# Altium schematic sheet Quadrature Decoder.SchDoc
size A4
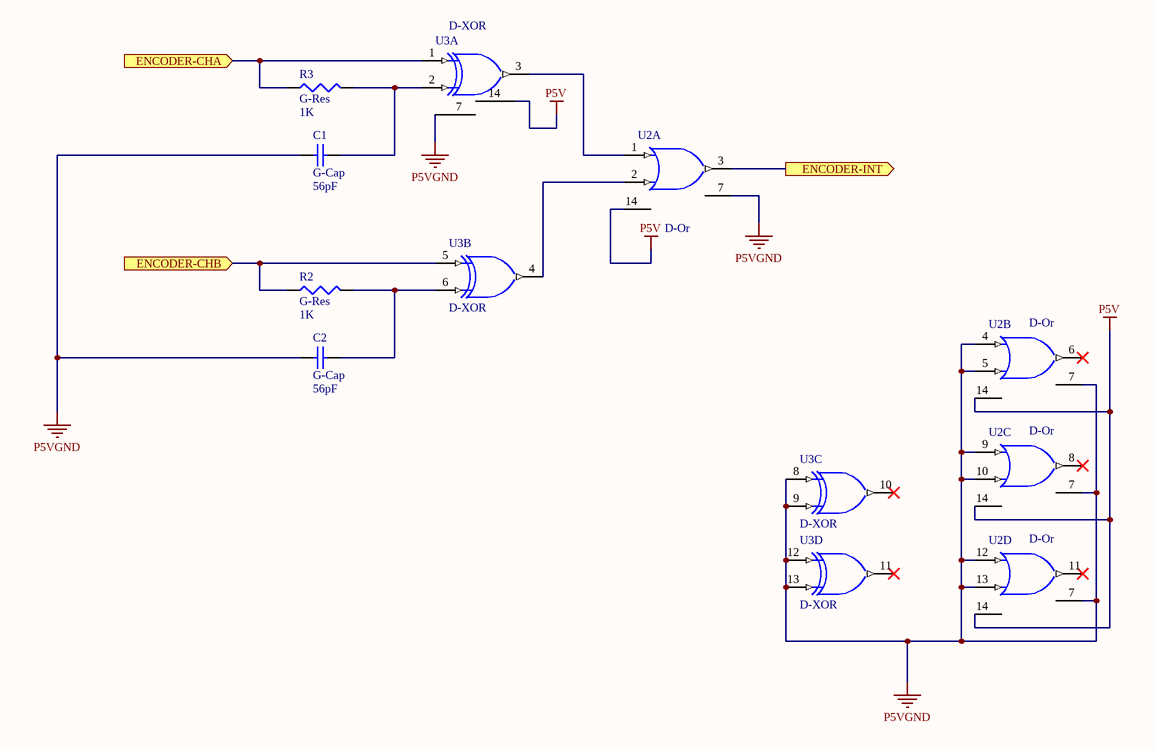
[diagram p0: Quadrature Decoder.SchDoc]

## Parts
C1  G-Cap  value 56pF  [Cap2.54mm_LGE1.0]
C2  G-Cap  value 56pF  [Cap2.54mm_LGE1.0]
R2  G-Res  value 1K  [Res2.54mm_LGE1.0]
R3  G-Res  value 1K  [Res2.54mm_LGE1.0]
U2  D-Or  [DIP14_LGE1.0]  (parts A,B,C,D of 4)
U3  D-XOR  [DIP14_LGE1.0]  (parts A,B,C,D of 4)

## Ports
ENCODER-CHA (in), ENCODER-CHB (in), ENCODER-INT (out)

## Nets
GND: C1.1 C2.1 U2.4(A) U2.5(B) U2.7(GND) U2.9(A) U2.10(B) U2.12(A) U2.13(B) U3.7(GND) U3.8(E) U3.9(F) U3.12(G) U3.13(H)  [also labelled P5VGND]
P5V: U2.14(VCC) U3.14(VCC)  [also labelled VCC]
ENCODER-CHA: R3.1 U3.1(A) ; port ENCODER-CHA
ENCODER-CHB: R2.1 U3.5(C) ; port ENCODER-CHB
ENCODER-INT: U2.3(Y) ; port ENCODER-INT
NetC1_2: C1.2 R3.2 U3.2(B)
NetC2_2: C2.2 R2.2 U3.6(D)
NetU2_1: U2.1(A) U3.3(J)
NetU2_2: U2.2(B) U3.4(K)

Not connected (* = marked no-connect by the designer): U2 6(Y)* 8(Y)* 11(Y)*; U3 10(L)* 11(M)*

## Library data of the parts
C1 C2 = G-Cap: capacitor (specify value); Published: 8-Jun-2000; LatestRevisionDate: 17-Jul-2002; LatestRevisionNote: Re-released for DXP Platform.; PackageReference: RAD-0.3; Publisher: Altium Limited
R2 R3 = G-Res: resistor (specify value); Published: 8-Jun-2000; LatestRevisionDate: 29-May-2009; LatestRevisionNote: IPC-7351 Footprint Added.; PackageReference: J1-0603; Publisher: Altium Limited; PackageDescription: Chip Resistor
U2 = D-Or: quad 2-input OR gate; Published: 8-Jun-2000; LatestRevisionDate: 04-Mar-2005; LatestRevisionNote: Stylized 3D Model Added.; DatasheetVersion: May-1999; PackageVersion: Oct-1995; PackageReference: N014; Publisher: Altium Limited; PackageDescription: DIP; 14 Leads; Row Spacing 7.62 mm; Pitch 2.54 mm; ComponentLink1Description: Manufacturer Link; ComponentLink1URL: http://www.ti.com/; ComponentLink2Description: Datasheet; ComponentLink2URL: http://www-s.ti.com/sc/ds/SN54F32.pdf
U3 = D-XOR: CD4070B